# EAGLE design headstage-64-coax-adapter (EAGLE 8.3.2)
DESIGNER: Jon Newman; DESIGN_NAME: Headstage-64 Coax Adapter (Protected); LICENSE: CC BY-NC-SA 4.0; REVISION: 1.0
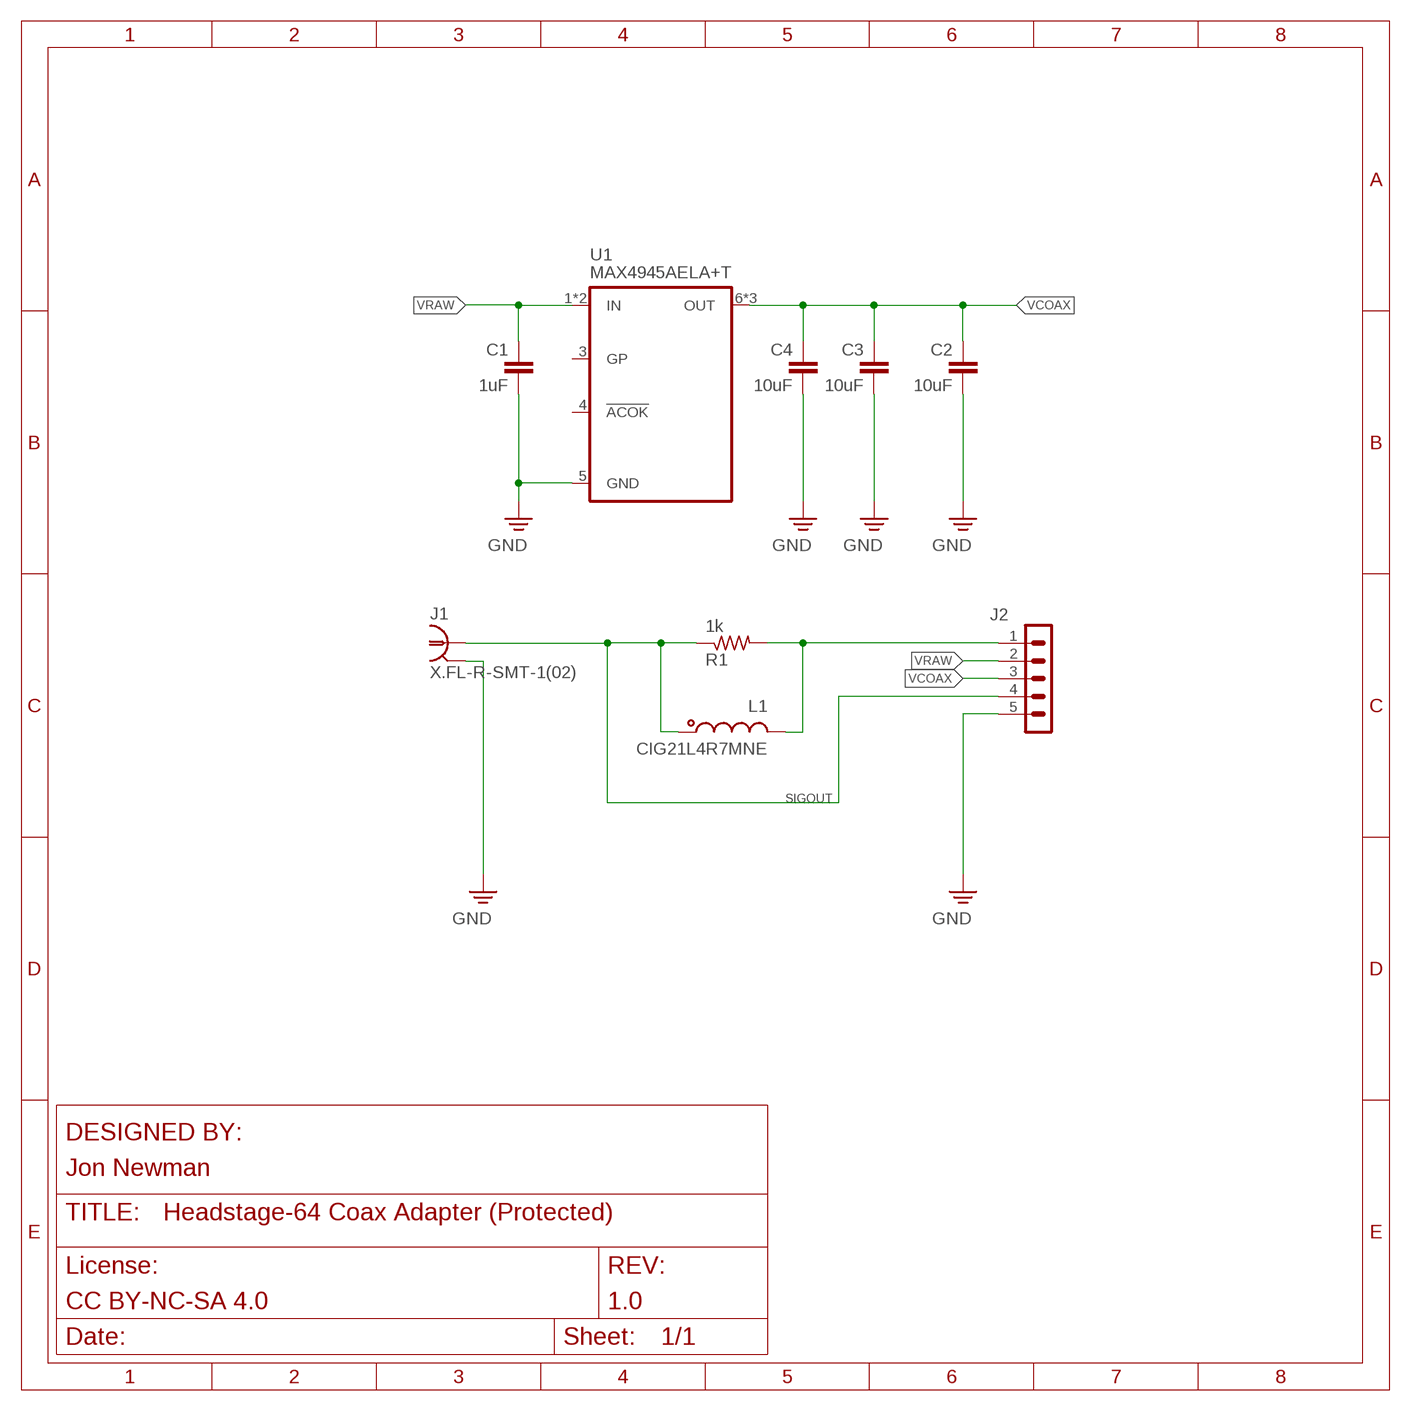
[diagram p0: schematic, sheet 1]

## Parts
C1  1uF  C_0402T  [0402T]
C2  10uF  C_0402T  [0402T]
C3  10uF  C_0603T  [0603T]
C4  10uF  C_0603T  [0603T]
J1  X.FL-R-SMT-1(02)  COAX_XFL  [X_FL_R_SMT_1(02)]
J2  PINHD-1X5_HEADSTAGE-64-REV1.4-DAUGHTER-CARD-CASTELLATED  [HEADSTAGE-64-REV1.4-DAUGHTER-CARD-CASTELLATED]
L1  CIG21L4R7MNE  L_0805T  [0805T]
R1  1k  R_0201T  [0201T]
U1  MAX4945AELA+T  MAX494X  [UDFN8-2X2]

## Nets
GND: C1.2 C2.2 C3.2 C4.2 J1.P$2 J1.P$3 J1.P$4 J2.5 U1.5(GND)
N$48: J2.1 L1.2 R1.2
SIGOUT: J1.P$1 J2.4 L1.1 R1.1
VCOAX: C2.1 C3.1 C4.1 J2.3 U1.6(OUT) U1.7(OUT) U1.8(OUT)
VRAW: C1.1 J2.2 U1.1(IN) U1.2(IN)
Unconnected: U1.3(GP) U1.4(!ACOK)

## Library data of the parts
C1-C4 = jonnew:C: Capacitor; PARTNO: CL05A475MO5NUNC
J1 = jonnew:COAX: COAX CONNECTOR - Edge mount BNC - Vertical BNC - Vertical SMA - etc
J2 = jonnew:PINHD-1X5
L1 = jonnew:L: Inductor
R1 = jonnew:R: Resistor
U1 = jonnew:MAX494X

## Board
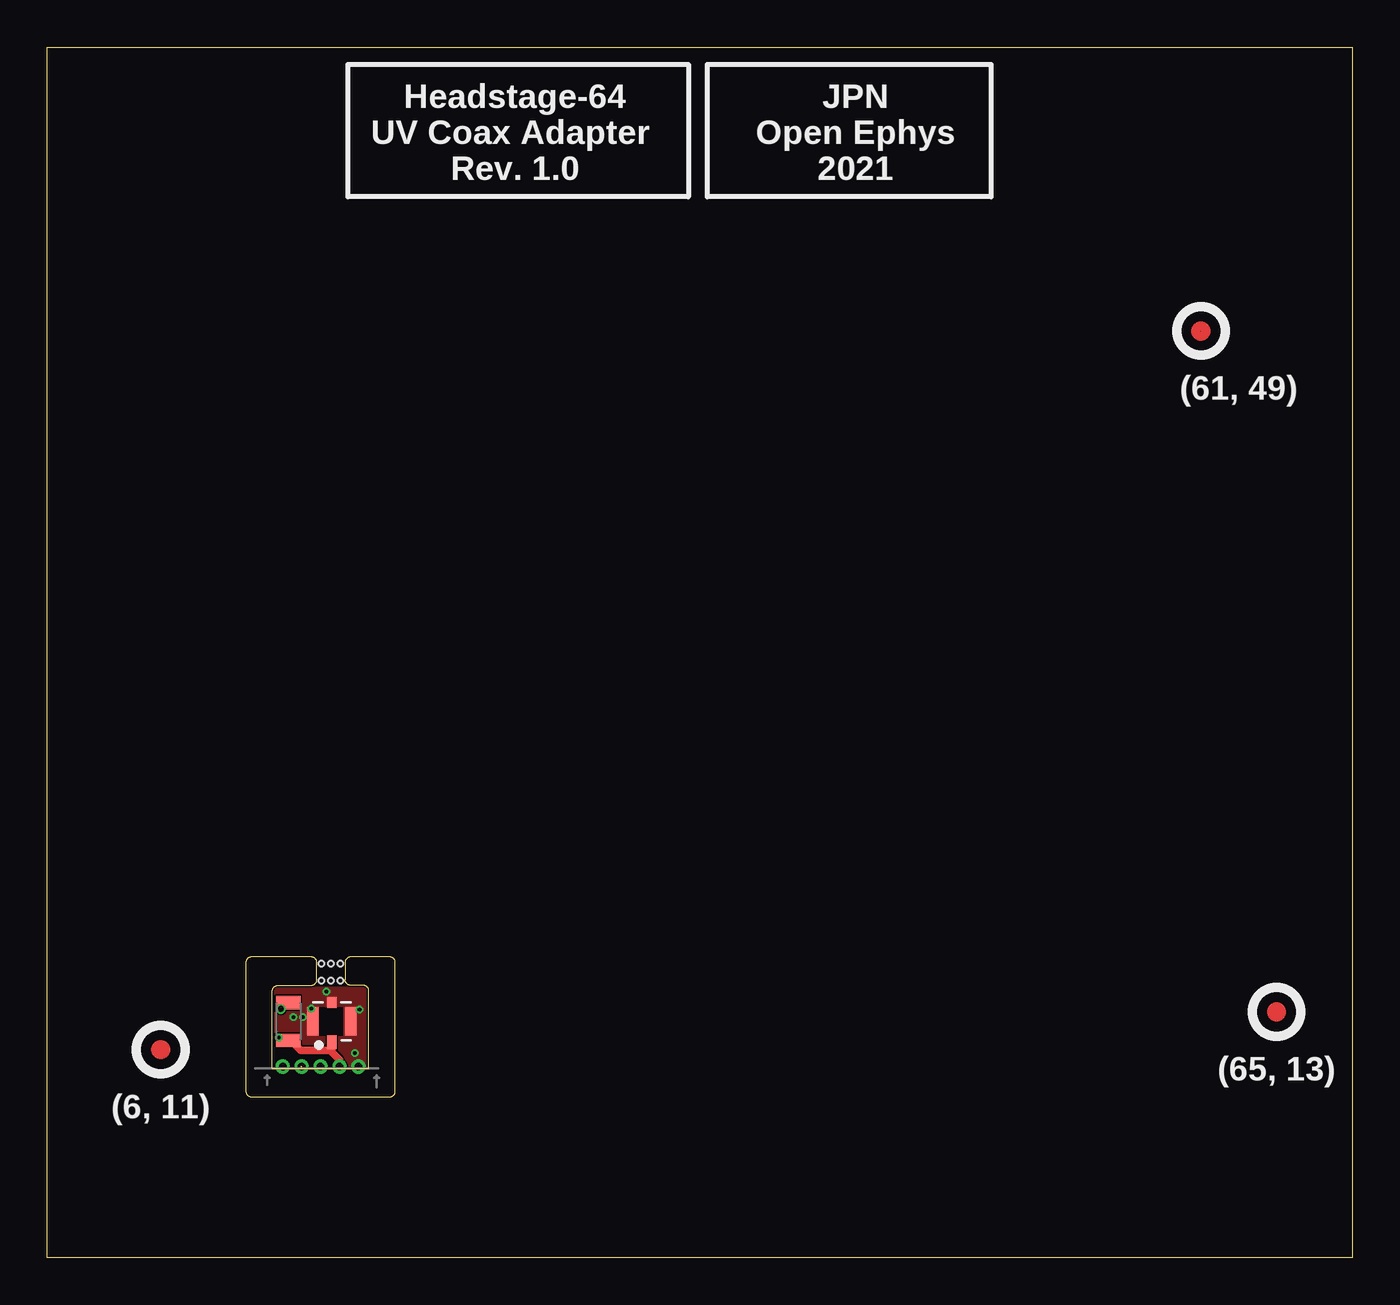
[diagram p1: board, top side]
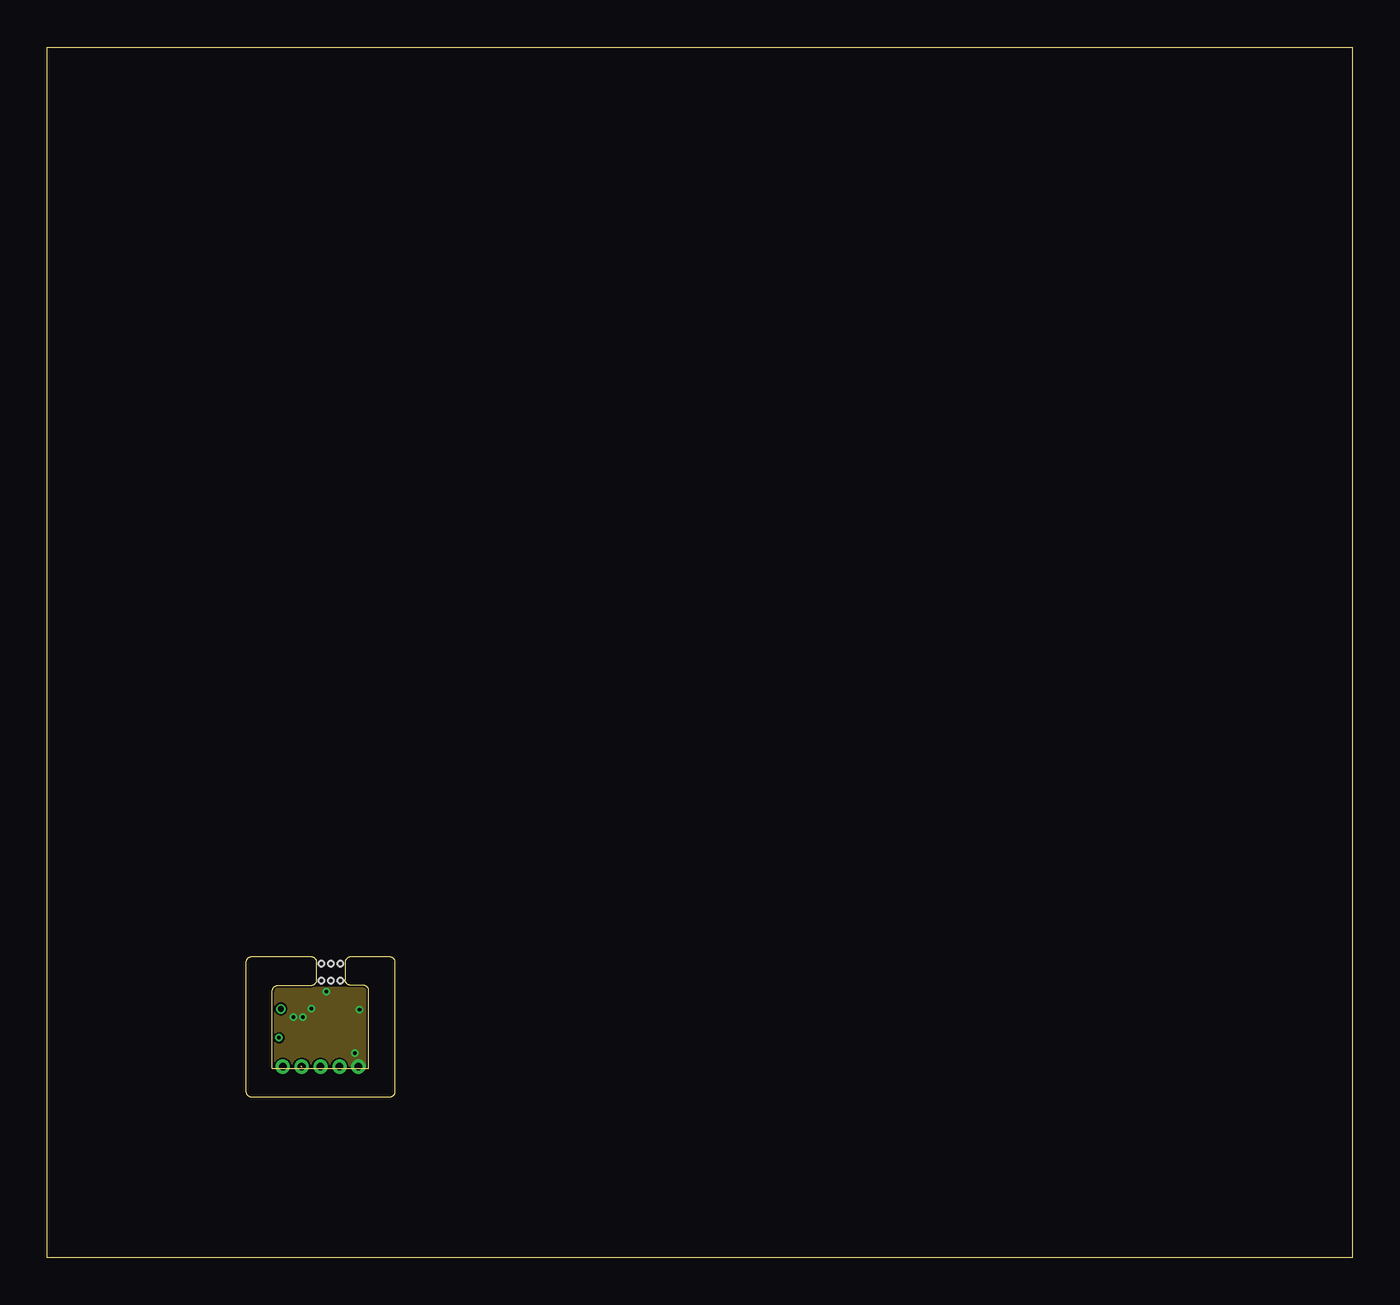
[diagram p2: board, inner layer Route2]
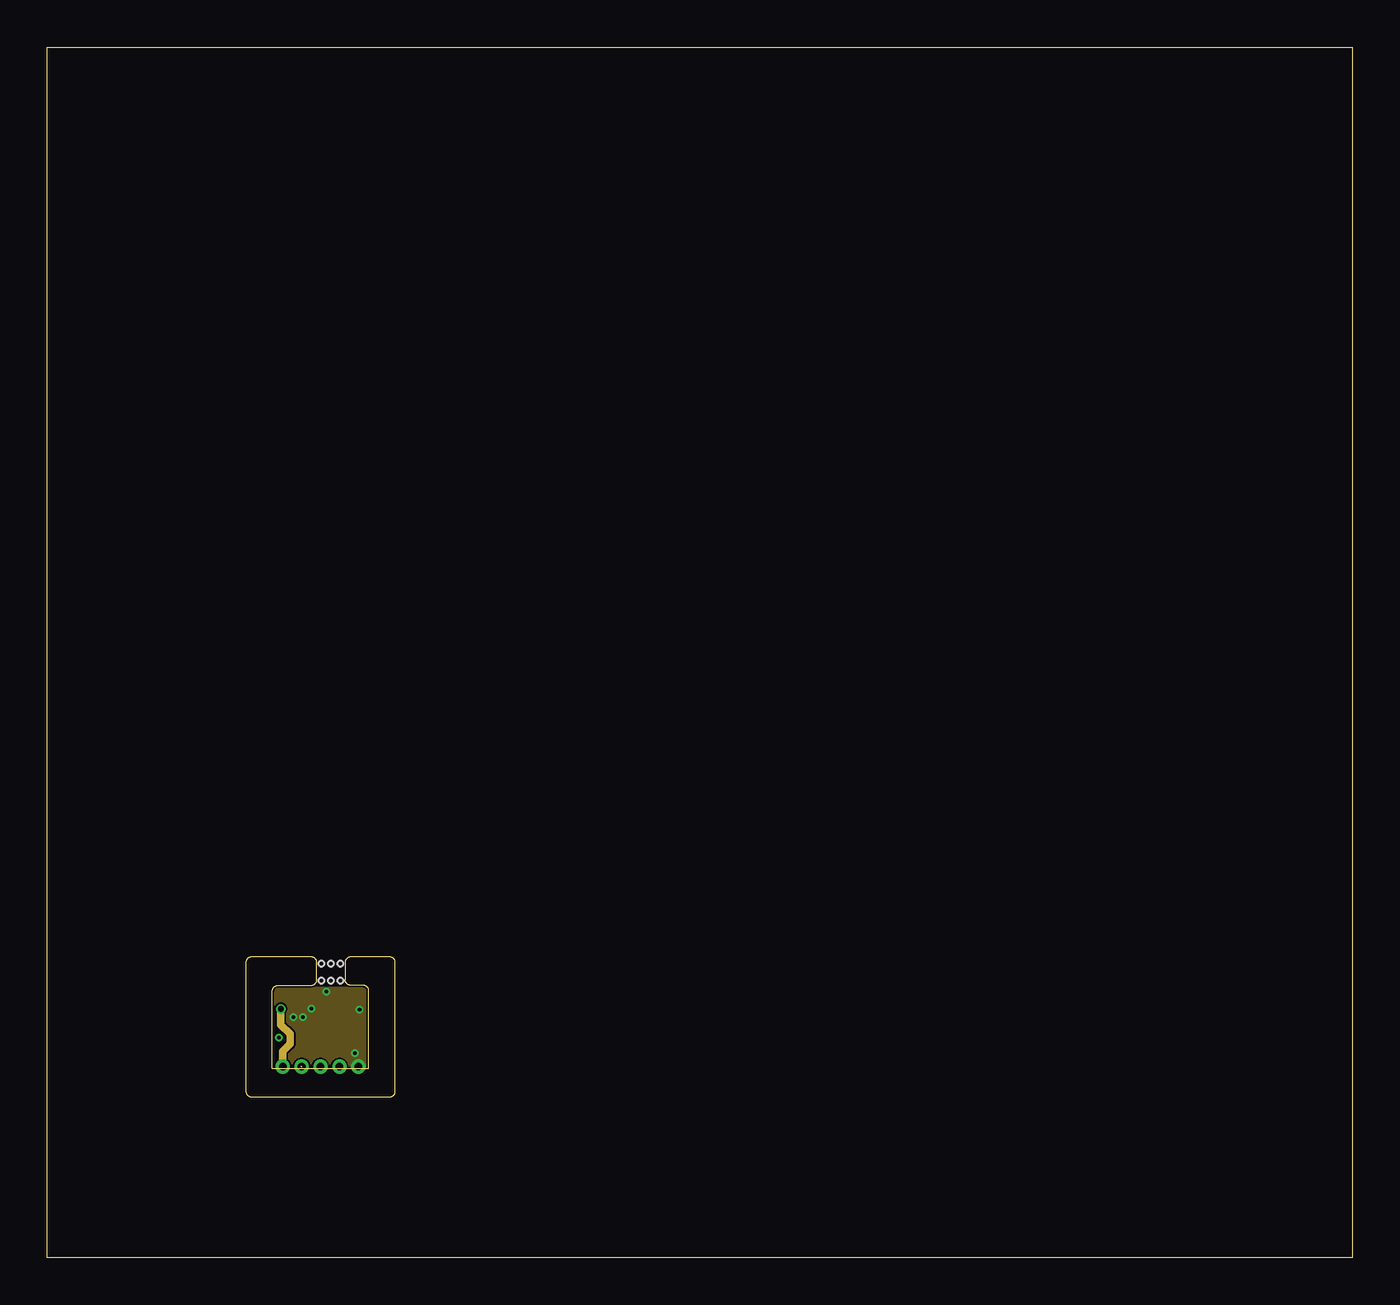
[diagram p3: board, inner layer Route15]
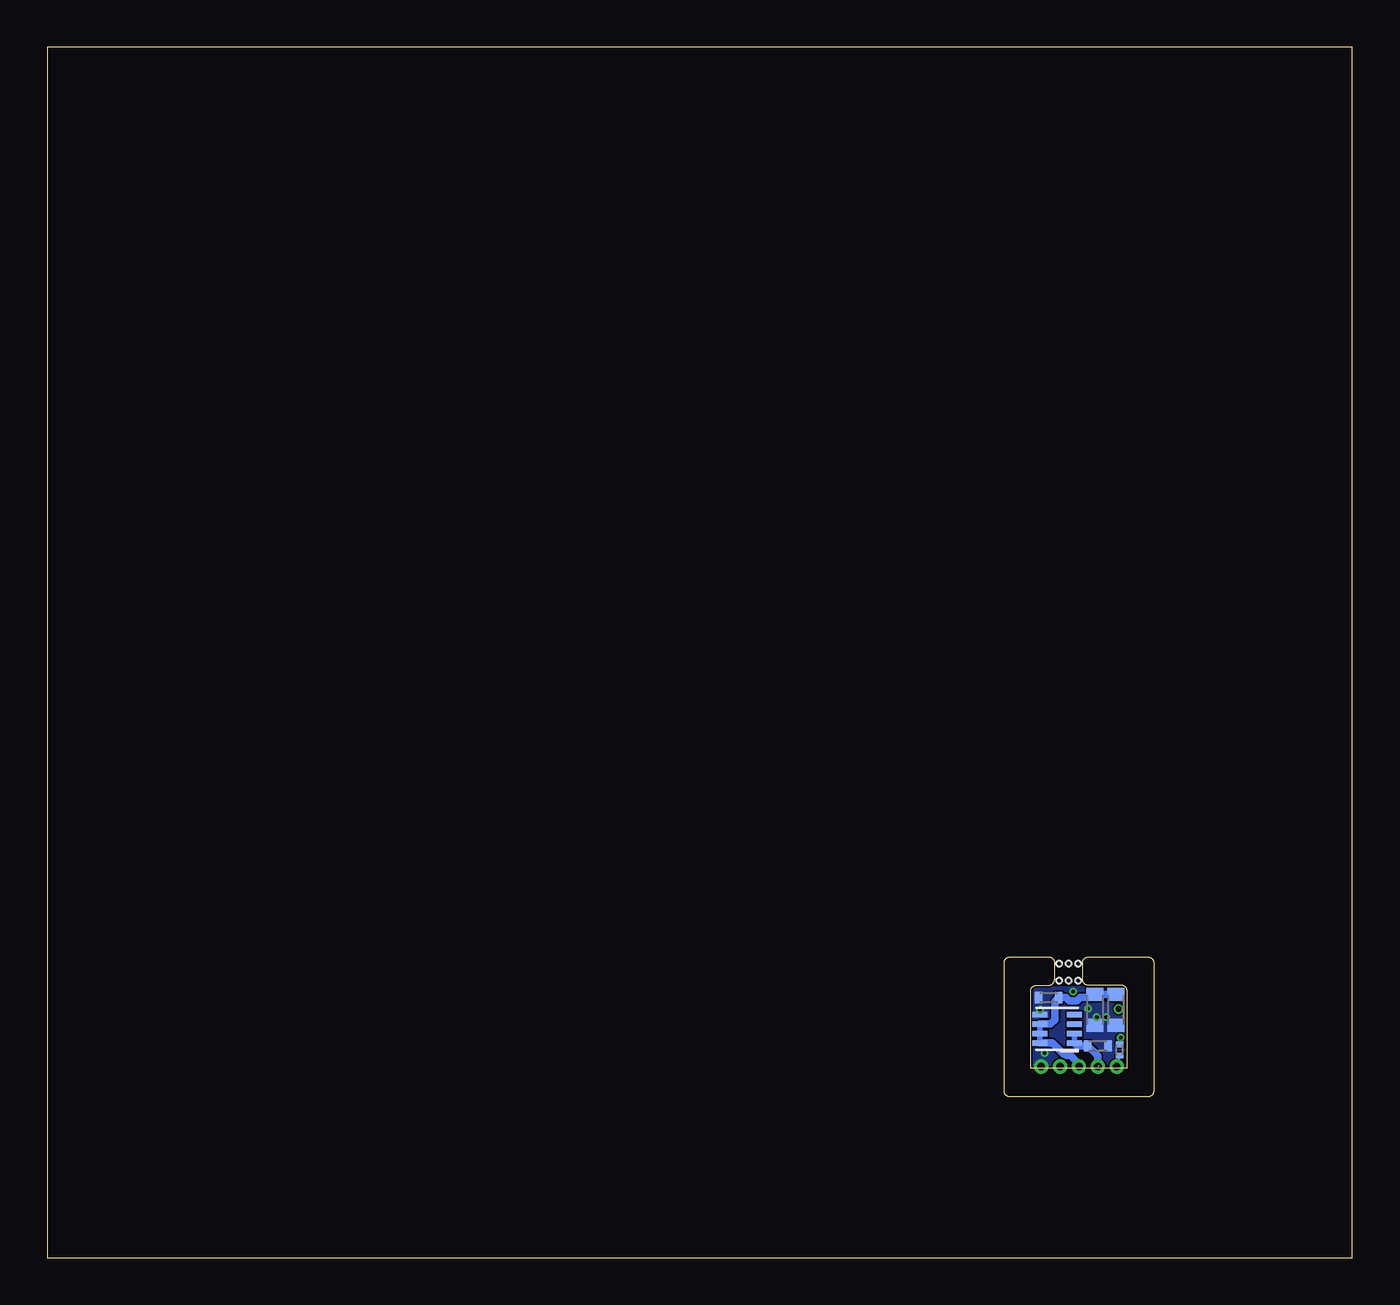
[diagram p4: board, bottom side, seen from below]

Size 69 x 64 mm. Coordinates in mm from the lower left corner, seen from the top.
Outline: 11.9,10 17,10 17,14.1 arc90 16.7,14.4 16.05,14.4 arc-90 15.75,14.7 15.75,15.6 arc-90 16.05,15.9 18.1,15.9 arc-90 18.4,15.6 18.4,8.8 arc-90 18.1,8.5 10.8,8.5 arc-90 10.5,8.8 10.5,15.6 arc-90 10.8,15.9 13.95,15.9 arc-90 14.25,15.6 14.25,14.7 arc-90 13.95,14.4 12.2,14.4 arc90 11.9,14.1 11.9,10
Outline: 0,0 0,64 69,64 69,0 0,0
Copper layers (1+2*15+16): Top 0.035mm / dielectric 0.2mm / Route2 0.0175mm / dielectric 1.065mm / Route15 0.0175mm / dielectric 0.2mm / Bottom 0.035mm
Design rules "jlcpcb-4-layer_JLC7628-stackup *": minimum track width 3.5mil, minimum drill 0.2mm, track to track 3.5mil, track to pad 3.5mil, pad to pad 3.5mil, via to via 3.5mil, smd to smd 0mil, copper to edge 0.1mm, drill to drill 3.5mil, minimum pad ring 4mil, minimum via ring 4mil, stop-mask expansion 1mil, vias tented up to drill 100mil, thermal gap 10mil
Holes 0.3 mm at 15,15.55 15,14.65 15.5,14.65 14.5,14.65 15.5,15.55 14.5,15.55

### Footprints (pad centres in the part's own frame; a part is rotated, then mirrored left to right if it is on the bottom)
0402T = smd 0.4 x 0.6: 1 -0.533,0; 2 0.533,0
0603T = smd 0.7 x 0.9: 1 -0.82,0; 2 0.82,0
X_FL_R_SMT_1(02) = smd 0.5 x 0.7: P$1 0,-1.1 | smd 0.6 x 1.5: P$2 -1,0; P$4 1,0 | smd 0.5 x 0.6: P$3 0,1
HEADSTAGE-64-REV1.4-DAUGHTER-CARD-CASTELLATED = drill 0.4 pad 0.75: 1 -2.55,0.1; 2 -1.55,0.1; 3 -0.55,0.1; 4 0.45,0.1; 5 1.45,0.1
0805T = smd 0.7 x 1.3: 1 -1,0; 2 1,0
0201T = smd 0.3 x 0.4: 1 -0.3,0; 2 0.3,0
UDFN8-2X2 = smd 0.8 x 0.3: 1 -0.91,0.75; 2 -0.91,0.25; 3 -0.91,-0.25; 4 -0.91,-0.75; 5 0.91,-0.75; 6 0.91,-0.25; 7 0.91,0.25; 8 0.91,0.75

### Placement (x,y rotation side)
C1  13.45,11.2 0 bottom
C2  16.05,13.75 180 bottom
C3  12.5,13.1 270 bottom
C4  13.6,13.1 270 bottom
E$1  [FIDUCIAL]  65,13 0 top
E$2  [FIDUCIAL]  61,49 0 top
E$4  [FIDUCIAL]  6,11 0 top
J1  15.05,12.5 0 top
J2  15,10 0 top
L1  12.75,12.49 90 top
R1  12.31,10.98 270 bottom
U1  15.6,12.1 180 bottom

### Tracks (layer width: path | path; a pad name or v marks a point on that pad's centre or on a via)
GND  (via drill 0.2)
  other vias: 13.96,13.17 16.51,13.12 16.26,10.82 13.51,12.72 13.01,12.72 14.76,14.07
  pour Bottom (isolate 0.02, rank 2, no thermals): 11.9,14.4 14,14.4 14.1,14.3 15.9,14.3 16,14.4 17,14.4 17,10 11.9,10
  pour Route15 (isolate 0.02, rank 2, no thermals): 11.9,14.4 14,14.4 14.1,14.3 15.9,14.3 16,14.4 17,14.4 17,10 11.9,10
  pour Top (isolate 0.02, rank 2, no thermals): 11.9,14.4 14,14.4 14.1,14.3 15.9,14.3 16,14.4 17,14.4 17,10 11.9,10
  pour Route2 (isolate 0.02, rank 2, no thermals): 11.9,14.4 14,14.4 14.1,14.3 15.9,14.3 16,14.4 17,14.4 17,10 11.9,10
N$48  (via drill 0.3)
  Top 0.4: L1.2 12.69,13.49 v12.35,13.15
  Route15 0.4: v12.35,13.15 12.35,12.32 12.85,11.82 12.85,11.3 12.45,10.9 J2.1
  Bottom 0.1: J2.1 12.31,10.24 R1.2
SIGOUT  (via drill 0.2)
  Top 0.1: v12.25,11.63 12.38,11.5 L1.1
  Top 0.127: 12.66,11.5 12.41,11.5
  Top 0.4: 12.66,11.5 L1.1 12.86,11.49 13.4,10.95 14.95,10.95 | J2.4 15.45,10.45 14.95,10.95 | J1.P$1 15.05,11.05 14.95,10.95
  Bottom 0.1: R1.1 12.25,11.34 v12.25,11.63
VCOAX
  Bottom 0.3: U1.6 U1.7 U1.8
  Bottom 0.4: C3.1 C4.1 13.77,13.75 14.39,13.75 14.56,13.58 14.96,13.58 15.13,13.75 C2.1 15.72,13.55 15.72,12.58 15.95,12.35 U1.6 | J2.3 14.45,10.25 14.9,10.7 15.11,10.7 15.18,10.76 15.26,10.76 15.85,11.35 U1.8
VRAW  (1 unrouted)
  Bottom 0.3: U1.2 U1.1
  Bottom 0.4: J2.2 13.45,10.67 C1.1 14.54,11.2 U1.1

### Text on the board
tPlace: Headstage-64 / UV Coax Adapter / Rev. 1.0 | JPN / Open Ephys / 2021 | (61, 49) | (65, 13) | (6, 11)